# Altium schematic sheet plc_module_xs.00001.001_KQ330.SchDoc: =GlobalProjectName
size 410 x 297 mm; ApprovedBy: Утвердил; CheckedBy: Проверил; Author: Разработал; SheetNumber: Лист; SheetTotal: Листов; PageSetup: Record=PageOptions|CenterHorizontal=True|CenterVertical=True|PrintScale=1.00|XCorrection=1.00|YCorrection=1.00|PrintKind=1|BorderSize=5000000|LeftOffset=0|BottomOffset=0|Orientation=2|PaperLength=1000|PaperWidth=1000|Scale=100|PaperSource=15|PrintQuality=1200|MediaType=1|DitherType=10|PaperKind=A3|PrintScaleMode=1; Weight: -; ScaleFactor: -; NormInspection: Норм.Контр.
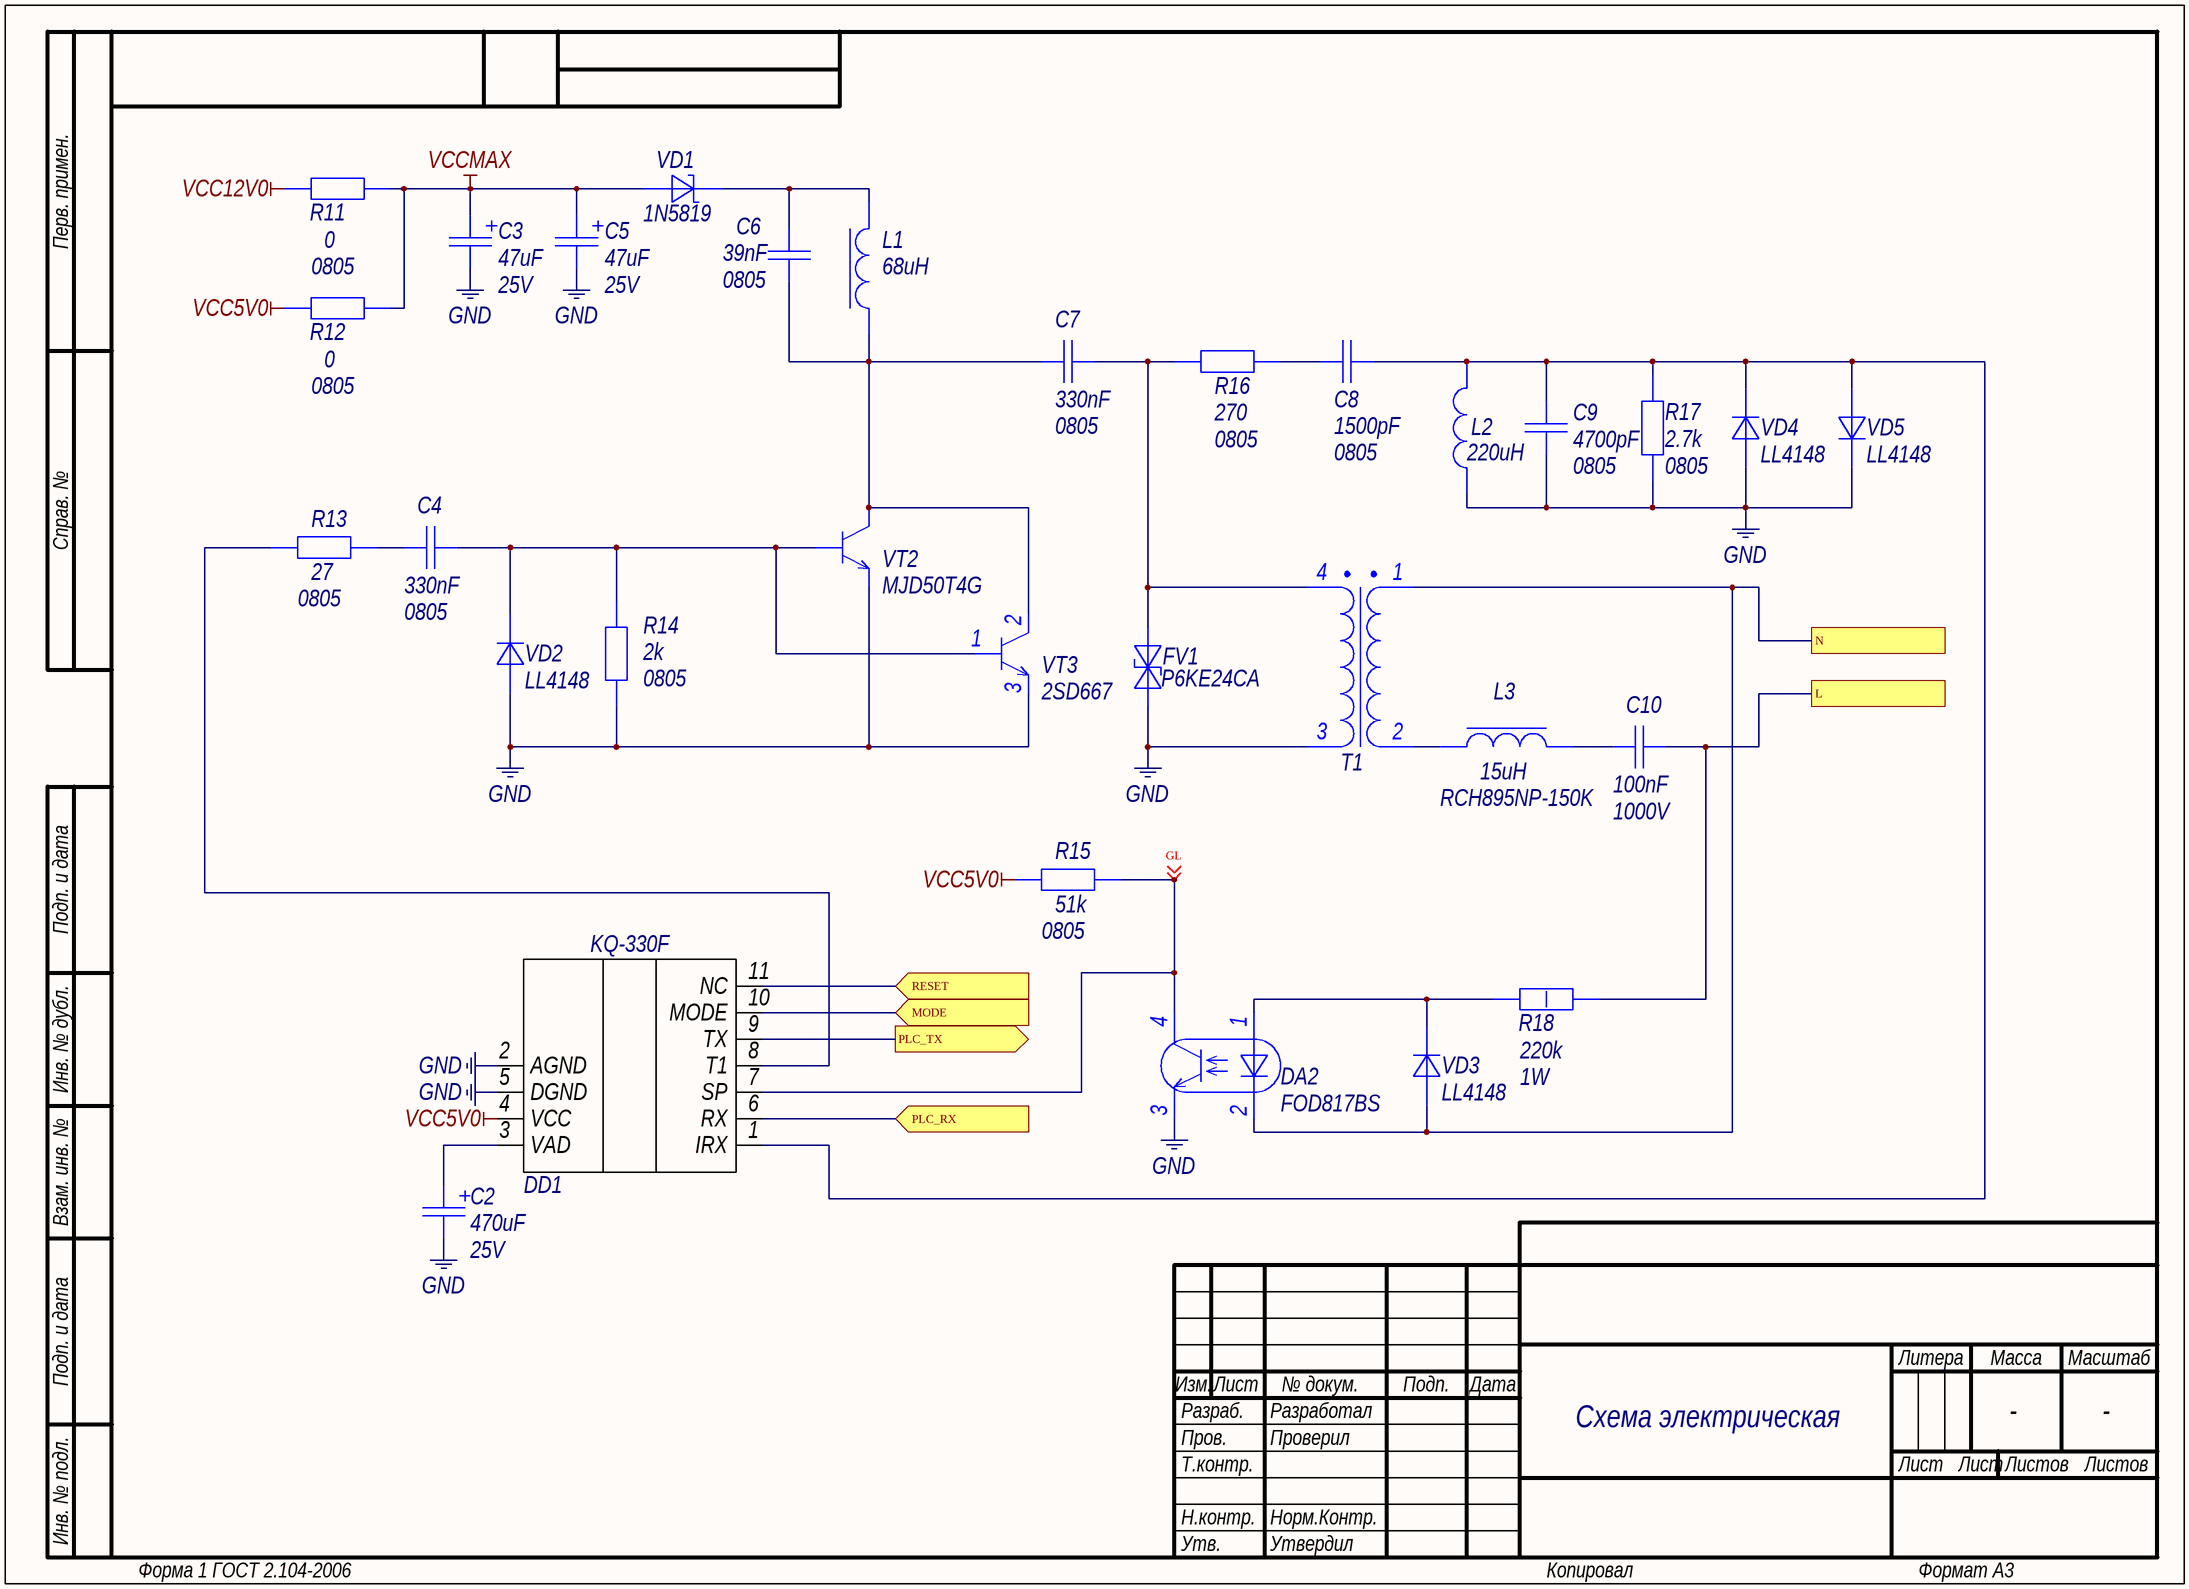
[diagram p0: plc_module_xs.00001.001_KQ330.SchDoc]

## Parts
C2  value 470uF  Voltage: 25V  [CAPAE1030X1020N]  (hidden comment: EEEFK1E471P)
C3  value 47uF  Voltage: 25V  [CAPAE660X540N]  (hidden comment: EEEFK1E470P)
C4  Footprint: 0805  [C0805]  (hidden comment: 330nF)
C5  value 47uF  Voltage: 25V  [CAPAE660X540N]  (hidden comment: EEEFK1E470P)
C6  Footprint: 0805  [C0805]  (hidden comment: 39nF)
C7  Footprint: 0805  [C0805]  (hidden comment: 330nF)
C8  Footprint: 0805  [C0805]  (hidden comment: 1500pF)
C9  Footprint: 0805  [C0805]  (hidden comment: 4700pF)
C10  value 100nF  Voltage: 1000V  [CAPR1500-800X1800X1500]  (hidden comment: B32652A104J)
DA2  FOD817BS  [SMD-4]
DD1  KQ-330F  [KQ-330F]
FV1  P6KE24CA  [DO-15]
L1  value 68uH  [RLB0914_BOURNS]  (hidden comment: RLB0914-680KL)
L2  value 220uH  [EC24]  (hidden comment: EC24-221K)
L3  value 15uH  [RLB0914_BOURNS]  (hidden comment: RCH895NP-150K)
R11  Footprint: 0805  [R0805]  (hidden comment: 0)
R12  Footprint: 0805  [R0805]  (hidden comment: 0)
R13  Footprint: 0805  [R0805]  (hidden comment: 27)
R14  Footprint: 0805  [R0805]  (hidden comment: 2k)
R15  Footprint: 0805  [R0805]  (hidden comment: 51k)
R16  Footprint: 0805  [R0805]  (hidden comment: 270)
R17  Footprint: 0805  [R0805]  (hidden comment: 2.7k)
R18  value 220k  Total Power Dissipation: 1W  [RES1651-1000X390]  (hidden comment: RSF200JB-73-220K)
T1  Coupling_Coil  [KQ330COIL]  (value not drawn)
VD1  1N5819  [DO-41]
VD2  LL4148  [SOD-80]
VD3  LL4148  [SOD-80]
VD4  LL4148  [SOD-80]
VD5  LL4148  [SOD-80]
VT2  MJD50T4G  [DIODES-INC_TO-252-3L]
VT3  Part Number: 2SD667  [TO-92-D]  (hidden comment: BJT-NPN)

## Ports
L, MODE (in), N, PLC_RX (in), PLC_TX (out), RESET (in)

## Nets
GND: C2.2 C3.2 C5.2 C9.2 DA2.3(Э) DD1.2(AGND) DD1.5(DGND) FV1.1(А) L2.1 R14.1 R17.2 T1.3 VD2.1(А) VD4.1(А) VD5.2(К) VT2.3(Э) VT3.3(Э)
VCC5V0: DD1.4(VCC) R12.1 R15.2
VCC12V0: R11.1
VCCMAX: C3.1 C5.1 R11.2 R12.2 VD1.2(А)
GL: DA2.4(К) DD1.7(SP) R15.1 ; off-sheet GL
L: C10.2 R18.2 ; port L
MODE: DD1.10(MODE) ; port MODE
N: DA2.2(CК) T1.1 VD3.1(А) ; port N
PLC_RX: DD1.6(RX) ; port PLC_RX
PLC_TX: DD1.9(TX) ; port PLC_TX
RESET: DD1.11(NC) ; port RESET
NetC2_1: C2.1 DD1.3(VAD)
NetC4_1: C4.1 R13.2
NetC4_2: C4.2 R14.2 VD2.2(К) VT2.1(Б) VT3.1(Б)
NetC6_1: C6.1 C7.1 L1.1 VT2.2(К) VT3.2(К)
NetC6_2: C6.2 L1.2 VD1.1(К)
NetC7_2: C7.2 FV1.2(К) R16.2 T1.4
NetC8_1: C8.1 R16.1
NetC8_2: C8.2 C9.1 DD1.1(IRX) L2.2 R17.1 VD4.2(К) VD5.1(А)
NetC10_1: C10.1 L3.2
NetDA2_1: DA2.1(CА) R18.1 VD3.2(К)
NetDD1_8: DD1.8(T1) R13.1
NetL3_1: L3.1 T1.2

## Notes on the sheet
- Схема электрическая
  принципиальная
- Перв. примен.
- Справ. №
- Подп. и дата
- Инв. № дубл.
- Взам. инв. №
- Разраб.
- Изм.
- Лист
- № докум.
- Подп.
- Дата
- Литера
- Масса
- Масштаб
- Пров.
- Т.контр.
- Листов
- Инв. № подл.
- Н.контр.
- Утв.
- Форма 1 ГОСТ 2.104-2006
- Копировал
- Формат А3

## Library data of the parts
C2 = EEEFK1E471P: Type: Конденсатор; ID: 1; Tolerance: 20%; ESR: 0.08ohm; URL1: <div><a href="https://www.terraelectronica.ru/product/310291">https://www.terraelectronica.ru/product/310291</a></div>; Published: 23.04.2010; Publisher: Andrew Danich; Part Number: EEEFK1E471P; Distributor1: terraelectronica; Distributor2: chipdip; URL2: https://www.chipdip.ru/product1/8000425032
C3 C5 = EEEFK1E470P: Manufacturer: PANASONIC; Type: Конденсатор; ID: 4; Tolerance: 20%; URL1: <div><a href="https://www.terraelectronica.ru/product/577701">https://www.terraelectronica.ru/product/577701</a></div>; Published: 23.04.2010; Publisher: Andrew Danich; Part Number: EEEFK1E470P; Distributor1: terraelectronica
C4 C7 = CC0805KKX7R9BB334: Manufacturer: Yageo; Type: Конденсатор; ID: 235; Voltage: 50V; Tolerance: ±10%; Dielectric Type: X7R; Application Category: 1; Working Temperature Min: -55°С; Working Temperature Max: +125°С; URL1: <div><a href="https://www.terraelectronica.ru/product/1078481">https://www.terraelectronica.ru/product/1078481</a></div>; Published: 18.05.2010; Publisher: Andrew Danich; Part Number: CC0805KKX7R9BB334; Value: 330nF; Distributor1: Terraelectronica
C6 = CC0805KRX7R9BB393: Manufacturer: Yageo; Type: Конденсатор; ID: 234; Voltage: 50V; Tolerance: ±5%; Dielectric Type: X7R; Application Category: 1; Working Temperature Min: -55°С; Working Temperature Max: +125°С; URL1: <div><a href="https://www.terraelectronica.ru/product/1080422">https://www.terraelectronica.ru/product/1080422</a></div>; Published: 18.05.2010; Publisher: Andrew Danich; Part Number: CC0805KRX7R9BB393; Value: 39nF; Distributor1: Terraelectronica
C8 = CC0805JRNPO9BN152: Manufacturer: Yageo; Type: Конденсатор; ID: 236; Voltage: 50V; Tolerance: ±5%; Dielectric Type: NP0; Application Category: 1; Working Temperature Min: -55°С; Working Temperature Max: +125°С; Published: 18.05.2010; Publisher: Andrew Danich; Part Number: CC0805JRNPO9BN152; Value: 1500pF; Distributor1: Terraelectronica
C9 = CC0805JKNPO9BN472: Manufacturer: Murata; Type: Конденсатор; ID: 233; Voltage: 50V; Tolerance: ±5%; Dielectric Type: NP0; Application Category: 1; Working Temperature Min: -55°С; Working Temperature Max: +125°С; Published: 18.05.2010; Publisher: Andrew Danich; Part Number: CC0805JKNPO9BN472; Value: 4700pF
C10 = B32652A104J: Manufacturer: EPCOS AG; Type: Конденсатор; ID: 1; Tolerance: 5%; Functional Analog: К73-17 имп, 0.1 мкФ, 1000 В, 5%  B32652A0104J; URL1: <div><a href="https://www.terraelectronica.ru/product/608082">https://www.terraelectronica.ru/product/608082</a></div>; Published: 18.05.2010; Publisher: Andrew Danich; Part Number: B32652A104J; Distributor1: terraelectronica; Distributor2: chipdip; URL2: https://www.chipdip.ru/product/b32652a0104j000
DA2 = FOD817BS: ID: 15; Input Voltage: 1.2V; Input Current: 20mA; Output Voltage: 35V; Output Current: 50mA; Total Power Dissipation: 150mW; Current Transfer Ratio: 50…600%; Cut-off Frequency: 80kHz; Application Category: 1; Published: 09.01.2017; Publisher: Andrew Danich; Type: Микросхема; Part Number: FOD817BS; Value: FOD817BS
DD1 = KQ-330F: Manufacturer: kq100.com; ID: 1; Data Rate: 1200bps; Input Speed: 9600baud; Application Type: Transceiver; Input Interface: UART; Published: 18.08.2014; Publisher: Andrew Danich; Type: Микросхема; Part Number: KQ-330F; Value: KQ-330F; Functional Analog: -; Distributor1: Alibaba; Distributor2: Taobao
FV1 = P6KE24CA: Suppressor-Bi; ID: 1; Reverse Voltage: 20.5V; Reverse Current: 100A; Total Power Dissipation: 0; Published: 27.07.2015; Publisher: Andrew Danich; Type: Супрессор; Part Number: P6KE24CA; Value: P6KE24CA
L1 = RLB0914-680KL: Type: Дроссель; ID: 9; Rated Current: 1200mA; Tolerance: 10%; Q: 30; DC Resistance: 0.2Ohm; Self-Resonant Frequency: 4.5MHz; Published: 20.05.2010; Publisher: Andrew Danich; Part Number: RLB0914-680KL
L2 = EC24-221K: Type: Дроссель; ID: 8; Rated Current: 130mA; Tolerance: 10%; Q: 60; DC Resistance: 5.7Ohm; Self-Resonant Frequency: 4MHz; URL1: <div><a href="https://www.chipdip.ru/product/ec24-221k">https://www.chipdip.ru/product/ec24-221k</a></div>; Published: 20.05.2010; Publisher: Andrew Danich; Part Number: EC24-221K; Distributor1: ChipDip
L3 = RCH895NP-150K: Type: Дроссель; ID: 11; Rated Current: 1.8A; Tolerance: 10%; DC Resistance: 0.05Ohm; Published: 20.05.2010; Publisher: Andrew Danich; Part Number: RCH895NP-150K; Distributor2: terraelectronica; URL2: https://www.terraelectronica.ru/product/213295
R11 R12 = RC0805JR-070RL: Manufacturer: Yageo; ID: 421; Limit Voltage: 150V; Tolerance: ±5%; Temperature Coefficient: 100ppm; Total Power Dissipation: 0.125W; Series Type: Thick-Film; Application Category: 1; Working Temperature Min: -55°С; Working Temperature Max: +155°С; Published: 24.03.2010; Publisher: Andrew Danich; Type: Резистор; Part Number: RC0805JR-070RL; Value: 0
R13 = RC0805JR-0727RL: Manufacturer: Yageo; ID: 125; Limit Voltage: 150V; Tolerance: ±5%; Temperature Coefficient: 100ppm; Total Power Dissipation: 0.125W; Series Type: Thick-Film; Application Category: 1; Working Temperature Min: -55°С; Working Temperature Max: +155°С; Published: 24.03.2010; Publisher: Andrew Danich; Type: Резистор; Part Number: RC0805JR-0727RL; Value: 27
R14 = RC0805JR-072KL: Manufacturer: Yageo; ID: 129; Limit Voltage: 150V; Tolerance: ±5%; Temperature Coefficient: 100ppm; Total Power Dissipation: 0.125W; Series Type: Thick-Film; Application Category: 1; Working Temperature Min: -55°С; Working Temperature Max: +155°С; Published: 24.03.2010; Publisher: Andrew Danich; Type: Резистор; Part Number: RC0805JR-072KL; Value: 2k
R15 = RC0805JR-0751KL: Manufacturer: Yageo; ID: 154; Limit Voltage: 150V; Tolerance: ±5%; Temperature Coefficient: 100ppm; Total Power Dissipation: 0.125W; Series Type: Thick-Film; Application Category: 1; Working Temperature Min: -55°С; Working Temperature Max: +155°С; Published: 24.03.2010; Publisher: Andrew Danich; Type: Резистор; Part Number: RC0805JR-0751KL; Value: 51k
R16 = RC0805JR-07270RL: Manufacturer: Yageo; ID: 446; Limit Voltage: 150V; Tolerance: ±5%; Temperature Coefficient: 100ppm; Total Power Dissipation: 0.125W; Series Type: Thick-Film; Application Category: 1; Working Temperature Min: -55°С; Working Temperature Max: +155°С; Published: 24.03.2010; Publisher: Andrew Danich; Type: Резистор; Part Number: RC0805JR-07270RL; Value: 270
R17 = RC0805JR-072K7L: Manufacturer: Yageo; ID: 442; Limit Voltage: 150V; Tolerance: ±5%; Temperature Coefficient: 100ppm; Total Power Dissipation: 0.125W; Series Type: Thick-Film; Application Category: 1; Working Temperature Min: -55°С; Working Temperature Max: +155°С; URL1: <div><a href="https://www.terraelectronica.ru/product/558399">https://www.terraelectronica.ru/product/558399</a></div>; Published: 24.03.2010; Publisher: Andrew Danich; Type: Резистор; Part Number: RC0805JR-072K7L; Value: 2.7k; Distributor1: Terraelectronica; Distributor2: ChipDip; URL2: https://www.chipdip.ru/product0/8715864745
R18 = RSF200JB-73-220K: ID: 3; Limit Voltage: 500V; Tolerance: 5%; Series Type: CF-100; Published: 19.09.2014; Publisher: Andrew Danich; Type: Резистор; Part Number: RSF200JB-73-220K; Distributor1: chipdip
T1 = KQ330_Coupling_Coil: Power Line Communication Coupling Transformer; Type: Трансформатор; Published: 06.04.2010; Publisher: Viktor Klishin
VD1 = 1N5819: Manufacturer: ST Microelectronics; Type: Диод; ID: 1; Reverse Voltage: 50V; Reverse Current: 0.5mA; Forward Voltage: 0.55V; Forward Current: 1A; URL1: <div><a href="https://www.terraelectronica.ru/product/343651">https://www.terraelectronica.ru/product/343651</a></div>; Published: 18.05.2010; Publisher: Andrew Danich; Part Number: 1N5819; Value: 1N5819; Application Category: 1; Distributor1: terraelectronica; Distributor2: chipdip; URL2: https://www.chipdip.ru/product/1n5819-2
VD2-VD5 = LL4148: Type: Диод; ID: 1; Reverse Voltage: 100V; Reverse Current: 3uA; Forward Voltage: 1V; Forward Current: 200mA; Total Power Dissipation: 0.5W; Capacitance: 4pF; Recovery Time: 4nS; Published: 18.05.2010; Publisher: Andrew Danich; Part Number: LL4148; Value: LL4148
VT2 = MJD50T4G: BJT-NPN; Type: Транзистор; ID: 19; C-E Voltage: 40V; Collector Current: 1A; C-E Saturation Voltage: 1.0V; DC Current Gain: 10…150; Total Power Dissipation: 1.56W; Transition Frequency: 10MHz; URL1: <div><a href="https://www.terraelectronica.ru/product/259312">https://www.terraelectronica.ru/product/259312</a></div>; Published: 07.05.2013; Publisher: Andrew Danich; Part Number: MJD50T4G; Value: MJD50T4G; Distributor1: Terraelectronica; Distributor2: ChipDip; URL2: https://www.chipdip.ru/product1/8861890713
VT3 = 2SD667: Manufacturer: HITACHI; Type: Транзистор; ID: 1; Value: 2SD667; C-E Voltage: 80V; Collector Current: 1A; C-E Saturation Voltage: 1V; DC Current Gain: 30…320; Total Power Dissipation: 900mW; Transition Frequency: 140MHz; Working Temperature Min: -55°С; Working Temperature Max: +150°С; Published: 07.05.2013; Publisher: Andrew Danich